# EAGLE design trif F (EAGLE 6.1)
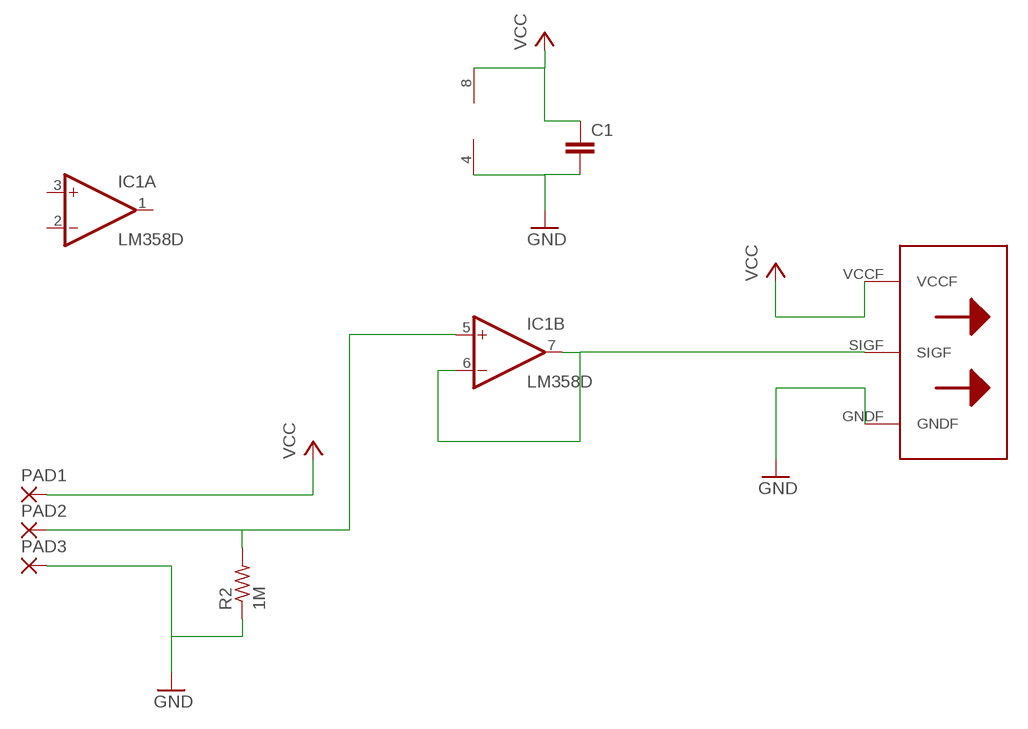
[diagram p0: schematic, sheet 1]

## Parts
C1  C-EUC1206K  [C1206K]
IC1  LM358D  [SO08]
PAD1  SMD2  [SMD1,27-2,54]
PAD2  SMD2  [SMD1,27-2,54]
PAD3  SMD2  [SMD1,27-2,54]
R2  1M  R-US_M0805  [M0805]
U$2  BITWIREF  [BITWIREF]

## Nets
N$1: IC1.6(B:-IN) IC1.7(B:OUT) U$2.SIGF
N$3: C1.2 IC1.4(P:V-) PAD3.1(P) R2.1 U$2.GNDF ; supply symbol labelled GND
SIG2: IC1.5(B:+IN) PAD2.1(P) R2.2
VCC: C1.1 IC1.8(P:V+) PAD1.1(P) U$2.VCCF
Unconnected: IC1.1(A:OUT) IC1.2(A:-IN) IC1.3(A:+IN)

## Library data of the parts
C1 = rcl:C-EU: CAPACITOR, European symbol
IC1 = linear:LM358: OP AMP also LM158; LM258; LM2904 Source: http://cache.national.com/ds/LM/LM158.pdf
PAD1-PAD3 = wirepad:SMD2: SMD PAD
R2 = rcl:R-US_: RESISTOR, American symbol
U$2 = bigbits:BITWIREF: Bit Wire Female Saída de Sinal -->>>>

## Board
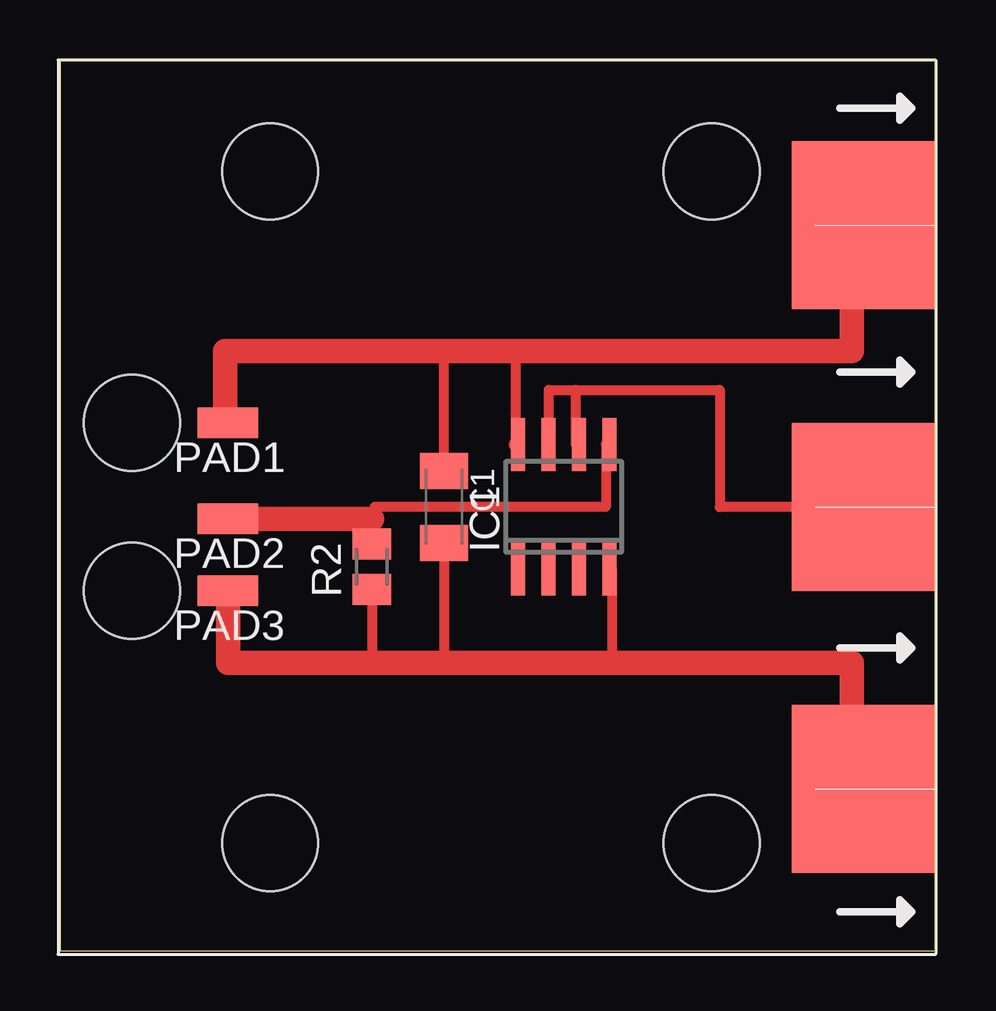
[diagram p1: board, top side]

Size 36.5 x 37.12 mm. Coordinates in mm from the lower left corner, seen from the top.
Outline: 0,0 36.5,0 36.5,37.12 0,37.12 0,0
Copper layers (1*16): Top 0.035mm / dielectric 1.5mm / Bottom 0.035mm
Design rules: minimum track width 10mil, minimum drill 24mil, track to track 8mil, track to pad 8mil, pad to pad 8mil, via to via 8mil, smd to smd 8mil, copper to edge 40mil, drill to drill 8mil, minimum pad ring 10mil, minimum via ring 8mil, stop-mask expansion 4mil, vias tented up to drill 0mil, thermal gap 10mil
Holes 4 mm at 3,22 3,15

### Footprints (pad centres in the part's own frame; a part is rotated, then mirrored left to right if it is on the bottom)
C1206K = smd 1.5 x 2: 1 -1.5,0; 2 1.5,0
SO08 = smd 0.6 x 2.2: 1 -1.905,-2.6; 2 -0.635,-2.6; 3 0.635,-2.6; 4 1.905,-2.6; 5 1.905,2.6; 6 0.635,2.6; 7 -0.635,2.6; 8 -1.905,2.6
SMD1,27-2,54 = smd 1.27 x 2.54: 1 0,0
M0805 = smd 1.3 x 1.6: 1 -0.95,0; 2 0.95,0
BITWIREF = smd 6 x 7: GNDF -3,-30.38; SIGF -3,-18.64; VCCF -3,-6.89 | hole 4: -9.34,-4.64; -9.34,-32.64; -27.74,-4.64; -27.74,-32.64

### Placement (x,y rotation side)
C1  16,18.5 270 top
IC1  21,18.5 0 top
PAD1  7,22 90 top
PAD2  7,18 90 top
PAD3  7,15 90 top
R2  13,16 90 top
U$2  36.5,37.12 0 top

### Tracks (layer width: path | path; a pad name or v marks a point on that pad's centre or on a via)
N$1
  Top 0.406: U$2.SIGF 27.5,18.48 27.5,23.38 21.5,23.38 | IC1.7 20.38,21.1 20.38,23.38 21.5,23.38 | IC1.6 21.5,21.1 21.5,23.38
N$3
  Top 0.406: R2.1 13,12 | C1.2 16,12 | IC1.4 23,15.9 23,12
  Top 1.016: U$2.GNDF 33,6.75 33,12 23,12 16,12 13,12 7,12 PAD3.1
SIG2
  Top 0.406: IC1.5 22.75,21.1 22.75,18.5 13.12,18.5 13.12,16.95 R2.2 13,18
  Top 1.016: 13,18 PAD2.1
VCC
  Top 0.406: 19,21.1 19,25 | C1.1 16,25 | PAD1.1 6.88,22
  Top 0.61: IC1.8 19,21.1
  Top 1.016: U$2.VCCF 33,30.23 33,25 19,25 16,25 6.88,25 6.88,22